# EAGLE design stepper-driver (EAGLE 5.00)
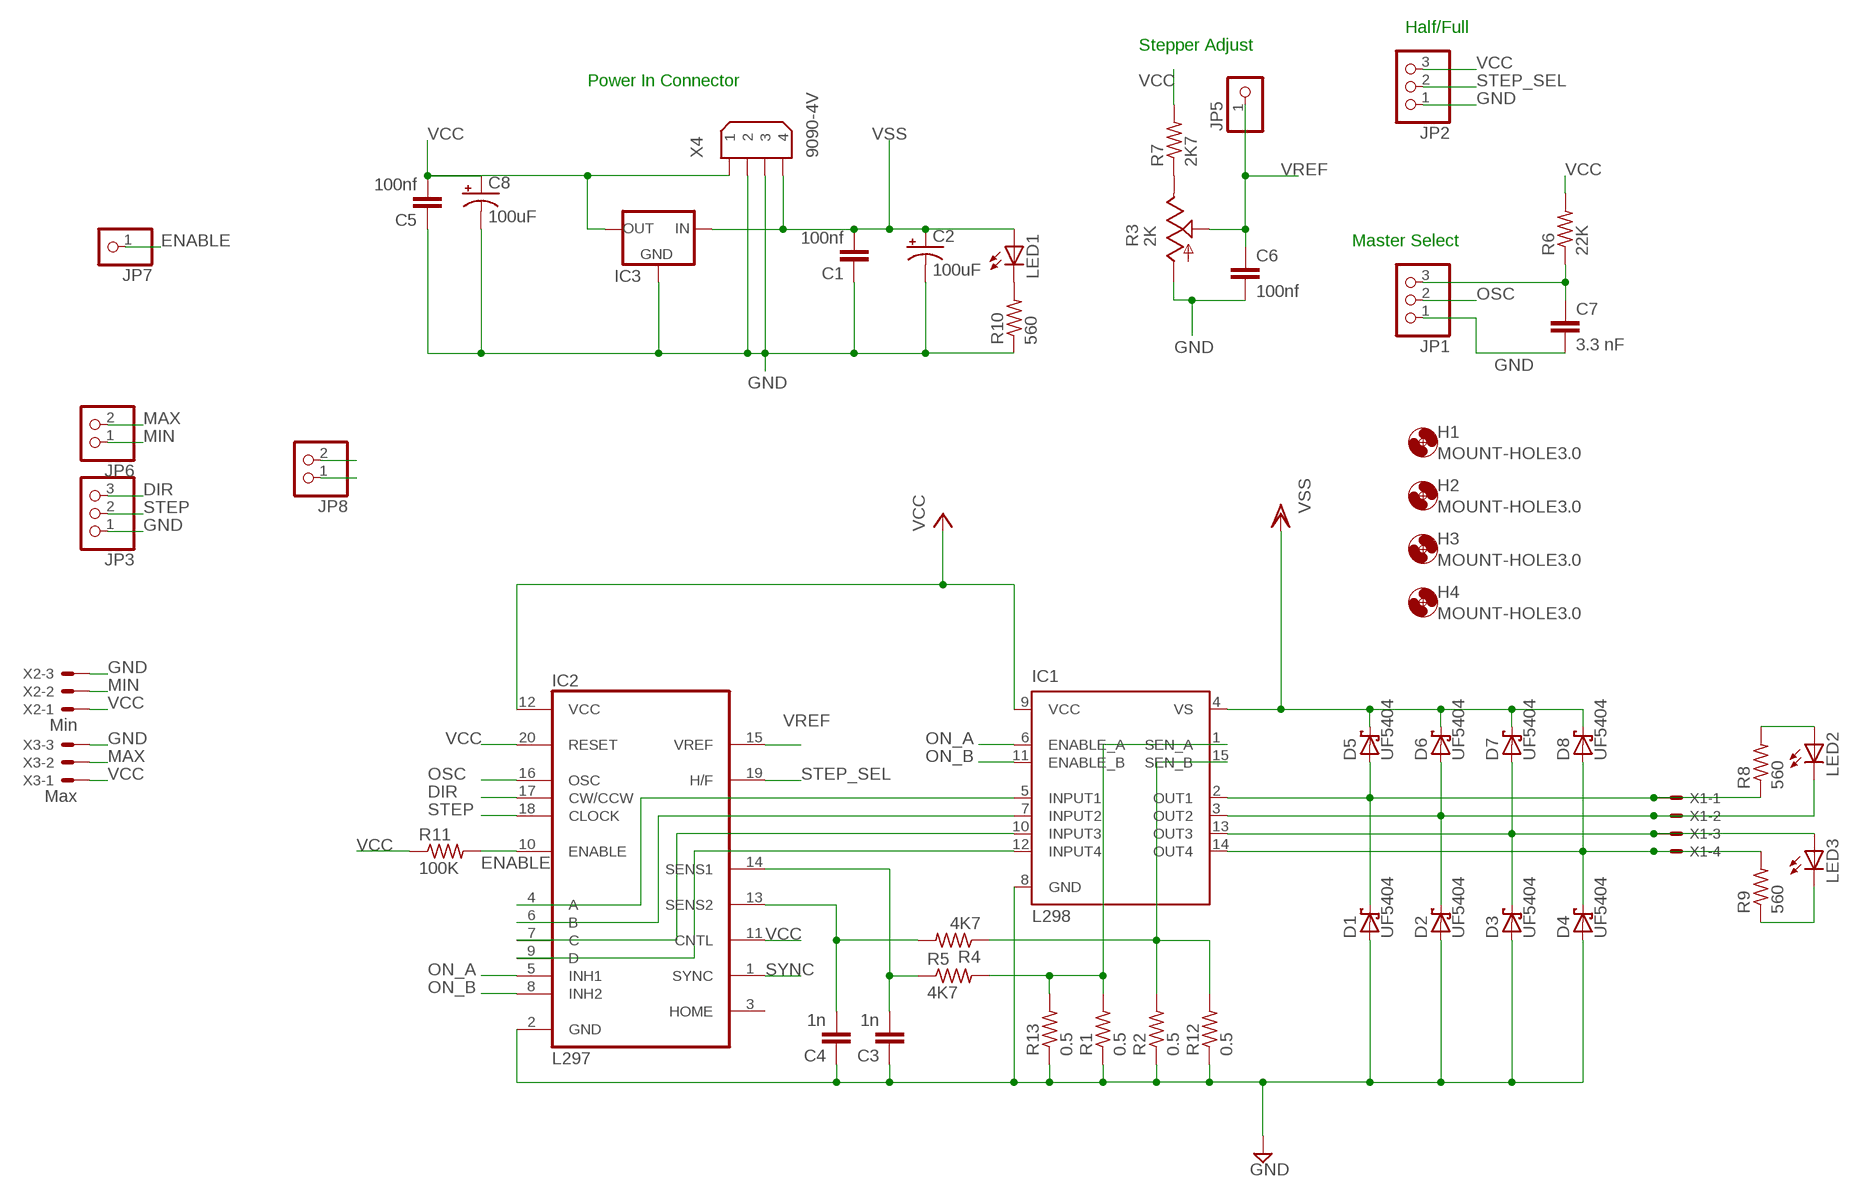
[diagram p0: schematic, sheet 1]

## Parts
C1  100nf  C-EU050-025X075  [C050-025X075]
C2  100uF  CPOL-USE5-6  [E5-6]
C3  1n  C-EU050-030X075  [C050-030X075]
C4  1n  C-EU050-030X075  [C050-030X075]
C5  100nf  C-EU050-025X075  [C050-025X075]
C6  100nf  C-EU050-035X075  [C050-035X075]
C7  3.3 nF  C5/3.5  [C5B3.5]
C8  100uF  CPOL-USE5-6  [E5-6]
D1  UF5404  SCHOTTKY-DIODECB429-15  [CB429-15]
D2  UF5404  SCHOTTKY-DIODECB429-15  [CB429-15]
D3  UF5404  SCHOTTKY-DIODECB429-15  [CB429-15]
D4  UF5404  SCHOTTKY-DIODECB429-15  [CB429-15]
D5  UF5404  SCHOTTKY-DIODECB429-15  [CB429-15]
D6  UF5404  SCHOTTKY-DIODECB429-15  [CB429-15]
D7  UF5404  SCHOTTKY-DIODECB429-15  [CB429-15]
D8  UF5404  SCHOTTKY-DIODECB429-15  [CB429-15]
H1  MOUNT-HOLE3.0  [3,0]
H2  MOUNT-HOLE3.0  [3,0]
H3  MOUNT-HOLE3.0  [3,0]
H4  MOUNT-HOLE3.0  [3,0]
IC1  L298  [MULTIWATT-15]
IC2  L297  [DIL20]
IC3  78LXX  [78LXX]
JP1  PINHD-1X3  [1X03]
JP2  PINHD-1X3  [1X03]
JP3  PINHD-1X3  [1X03]
JP5  PINHD-1X1  [1X01]
JP6  PINHD-1X2  [1X02]
JP7  PINHD-1X1  [1X01]
JP8  PINHD-1X2  [1X02]
LED1  LED5MM  [LED5MM]
LED2  LED3MM  [LED3MM]
LED3  LED3MM  [LED3MM]
R1  0.5  R-US_0309/12  [0309/12]
R2  0.5  R-US_0309/12  [0309/12]
R3  2K  TRIM_US-B25U  [B25U]
R4  4K7  R-US_0207/7  [0207/7]
R5  4K7  R-US_0207/7  [0207/7]
R6  22K  R-US_0207/7  [0207/7]
R7  2K7  R-US_0207/7  [0207/7]
R8  560  R-US_0207/7  [0207/7]
R9  560  R-US_0207/7  [0207/7]
R10  560  R-US_0207/7  [0207/7]
R11  100K  R-US_0207/7  [0207/7]
R12  0.5  R-US_0309/12  [0309/12]
R13  0.5  R-US_0309/12  [0309/12]
X1  KK-156-4  [KK-156-4]
X2  Min  22-23-2031  [22-23-2031]
X3  Max  22-23-2031  [22-23-2031]
X4  9090-4V  [9090-4V]

## Nets
DIR: IC2.17(CW/CCW) JP3.3
ENABLE: IC2.10(ENABLE) JP7.1 R11.2
GND [Ground]: C1.1 C2.- C3.1 C4.1 C5.1 C6.2 C7.2 C8.- D1.A D2.A D3.A D4.A IC1.8(GND) IC2.2(GND) IC3.GND JP1.1 JP2.1 JP3.1 R1.1 R2.1 R3.A R10.1 R12.1 R13.1 X2.3 X3.3 X4.2 X4.3
MAX: JP6.2 X3.2
MIN: JP6.1 X2.2
N$1: R3.E R7.1
N$2: LED3.K(C) R9.1
N$3: LED2.A R8.2
N$4: LED1.K(C) R10.2
N$25: IC1.5(INPUT1) IC2.4(A)
N$26: IC1.7(INPUT2) IC2.6(B)
N$27 [Power]: D4.C D8.A IC1.14(OUT4) R9.2 X1.4
N$28 [Power]: D3.C D7.A IC1.13(OUT3) LED3.A X1.3
N$29 [Power]: D2.C D6.A IC1.3(OUT2) LED2.K(C) X1.2
N$30 [Power]: D1.C D5.A IC1.2(OUT1) R8.1 X1.1
N$31: IC1.10(INPUT3) IC2.7(C)
N$32 [Power]: IC1.15(SEN_B) R2.2 R4.1 R12.2
N$33 [Power]: IC1.1(SEN_A) R1.2 R5.2 R13.2
N$34: IC1.12(INPUT4) IC2.9(D)
N$36: C4.2 IC2.13(SENS2) R4.2
N$37: C3.2 IC2.14(SENS1) R5.1
N$41: C7.1 JP1.3 R6.1
ON_A: IC1.6(ENABLE_A) IC2.5(INH1)
ON_B: IC1.11(ENABLE_B) IC2.8(INH2)
OSC: IC2.16(OSC) JP1.2
STEP: IC2.18(CLOCK) JP3.2
STEP_SEL: IC2.19(H/F) JP2.2
SYNC: IC2.1(SYNC) JP8.1 JP8.2
VCC: C5.2 C8.+ IC1.9(VCC) IC2.11(CNTL) IC2.12(VCC) IC2.20(RESET) IC3.OUT JP2.3 R6.2 R7.2 R11.1 X2.1 X3.1 X4.1
VREF: C6.1 IC2.15(VREF) JP5.1 R3.S
VSS [Power]: C1.2 C2.+ D5.C D6.C D7.C D8.C IC1.4(VS) IC3.IN LED1.A X4.4
Unconnected: IC2.3(HOME)

## Notes on the sheet
- Half/Full
- Stepper Adjust
- Power In Connector
- Master Select

## Library data of the parts
C1 C3-C6 = rcl:C-EU: CAPACITOR, European symbol
C2 C8 = rcl:CPOL-US: POLARIZED CAPACITOR, American symbol
C7 = capacitor-wima:C: CAPACITOR naming: grid - package width
D1-D8 = diode:SCHOTTKY-DIODE: Schottky Diode
H1-H4 = holes:MOUNT-HOLE: MOUNTING HOLE with drill center marker
IC1 = st-microelectronics:L298: DUAL FULL-BRIDGE DRIVER
IC2 = st-microelectronics:L297: STEPPER MOTOR CONTROLLER
IC3 = v-reg:78LXX: VOLTAGE REGULATOR
JP1-JP3 = pinhead:PINHD-1X3: PIN HEADER
JP5 JP7 = pinhead:PINHD-1X1: PIN HEADER
JP6 JP8 = pinhead:PINHD-1X2: PIN HEADER
LED1-LED3 = led:LED: LED OSRAM: - CHIPLED LG R971, LG N971, LY N971, LG Q971, LY Q971, LO R971, LY R971 LH N974, LH R974 LS Q976, LO Q976, LY Q976 LO Q996 - Hyper CHIPLED LW Q18S LB Q993, LB Q99A, LB R99A - SideLED LS A670, LO A670, LY A670, LG A670, LP A670 LB A673, LV A673, LT A673, LW A673 LH A674 LY A675 LS A676, LA A676, LO A676, LY A676, LW A676 LS A679, LY A679, LG A679 - Hyper Micro SIDELED® LS Y876, LA Y876, LO Y876, LY Y876 LT Y87S - SmartLED LW L88C, LW L88S LB L89C, LB L89S, LG L890 LS L89K, LO L89K, LY L89K LS L896, LA L896, LO L896, LY L896 - TOPLED LS T670, LO T670, LY T670, LG T670, LP T670 LSG T670, LSP T670, LSY T670, LOP T670, LYG T670 LG T671, LOG T671, LSG T671 LB T673, LV T673, LT T673, LW T673 LH T674 LS T676, LA T676, LO T676, LY T676, LB T676, LH T676, LSB T676, LW T676 LB T67C, LV T67C, LT T67C, LS T67K, LO T67K, LY T67K, LW E67C LS E67B, LA E67B, LO E67B, LY E67B, LB E67C, LV E67C, LT E67C LW T67C LS T679, LY T679, LG T679 LS T770, LO T770, LY T770, LG T770, LP T770 LB T773, LV T773, LT T773, LW T773 LH T774 LS E675, LA E675, LY E675, LS T675 LS T776, LA T776, LO T776, LY T776, LB T776 LHGB T686 LT T68C, LB T68C - Hyper Mini TOPLED® LB M676 - Mini TOPLED Santana® LG M470 LS M47K, LO M47K, LY M47K Source: http://www.osram.convergy.de - LUMILED® LXK2-PW12-R00, LXK2-PW12-S00, LXK2-PW14-U00, LXK2-PW14-V00 LXK2-PM12-R00, LXK2-PM12-S00, LXK2-PM14-U00 LXK2-PE12-Q00, LXK2-PE12-R00, LXK2-PE12-S00, LXK2-PE14-T00, LXK2-PE14-U00 LXK2-PB12-K00, LXK2-PB12-L00, LXK2-PB12-M00, LXK2-PB14-N00, LXK2-PB14-P00, LXK2-PB14-Q00 LXK2-PR12-L00, LXK2-PR12-M00, LXK2-PR14-Q00, LXK2-PR14-R00 LXK2-PD12-Q00, LXK2-PD12-R00, LXK2-PD12-S00 LXK2-PH12-R00, LXK2-PH12-S00 LXK2-PL12-P00, LXK2-PL12-Q00, LXK2-PL12-R00 Source: www.luxeon.com
R1 R2 R4-R13 = rcl:R-US_: RESISTOR, American symbol
R3 = pot:TRIM_US-: POTENTIOMETER
X1 = con-molex:KK-156-4: KK 156 HEADER Source: http://www.molex.com/pdm_docs/sd/026604100_sd.pdf
X2 X3 = con-molex:22-23-2031: .100" (2.54mm) Center Header - 3 Pin
X4 = con-thomas-betts:9090-4: Disk Drive Power four position Source: Thomas & Betts Electronic Interconnects Eiropean Edition 1998

## Net classes
0 default: width 0.406 mm, clearance 0.381 mm
1 Power: width 1.27 mm, clearance 0.381 mm
2 Signal: width 0.406 mm, clearance 0.381 mm
3 Ground: width 1.27 mm, clearance 0.381 mm

## Board
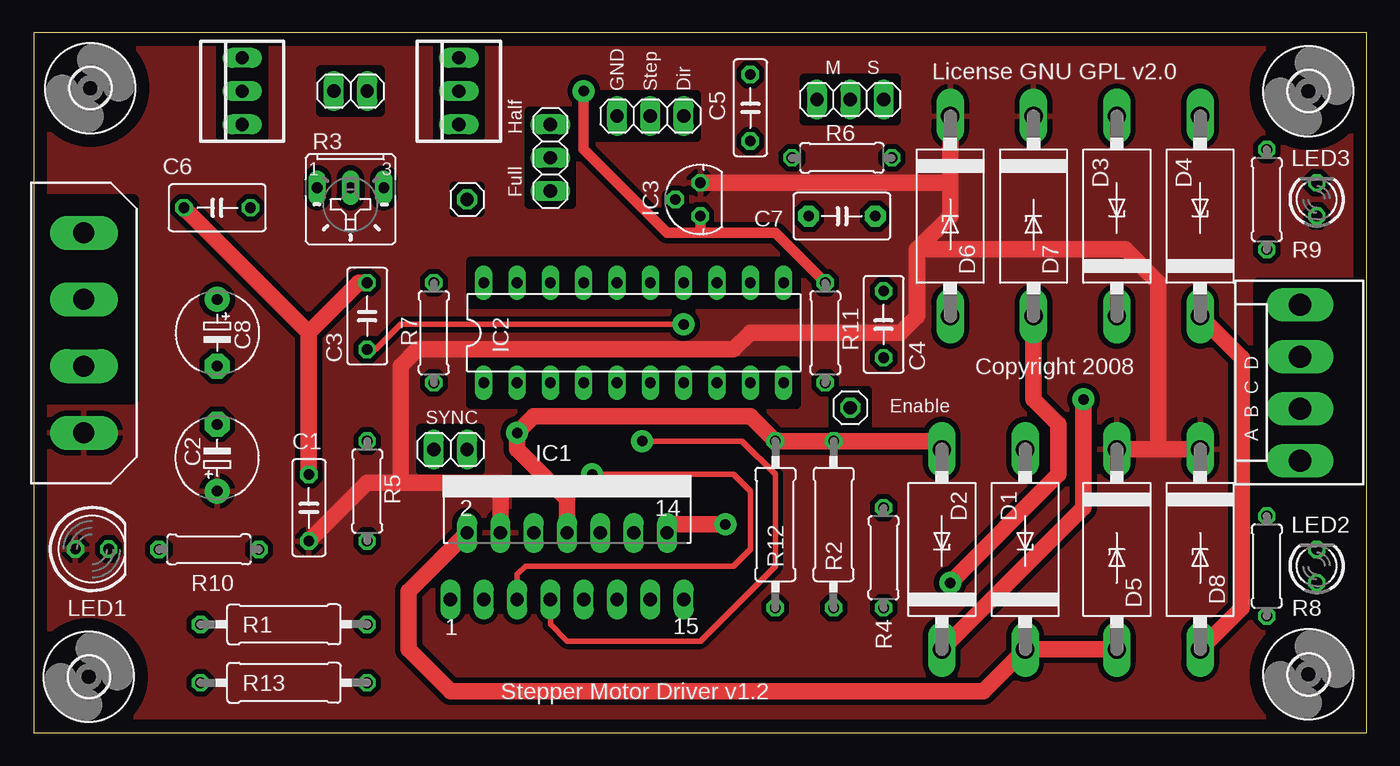
[diagram p1: board, top side]
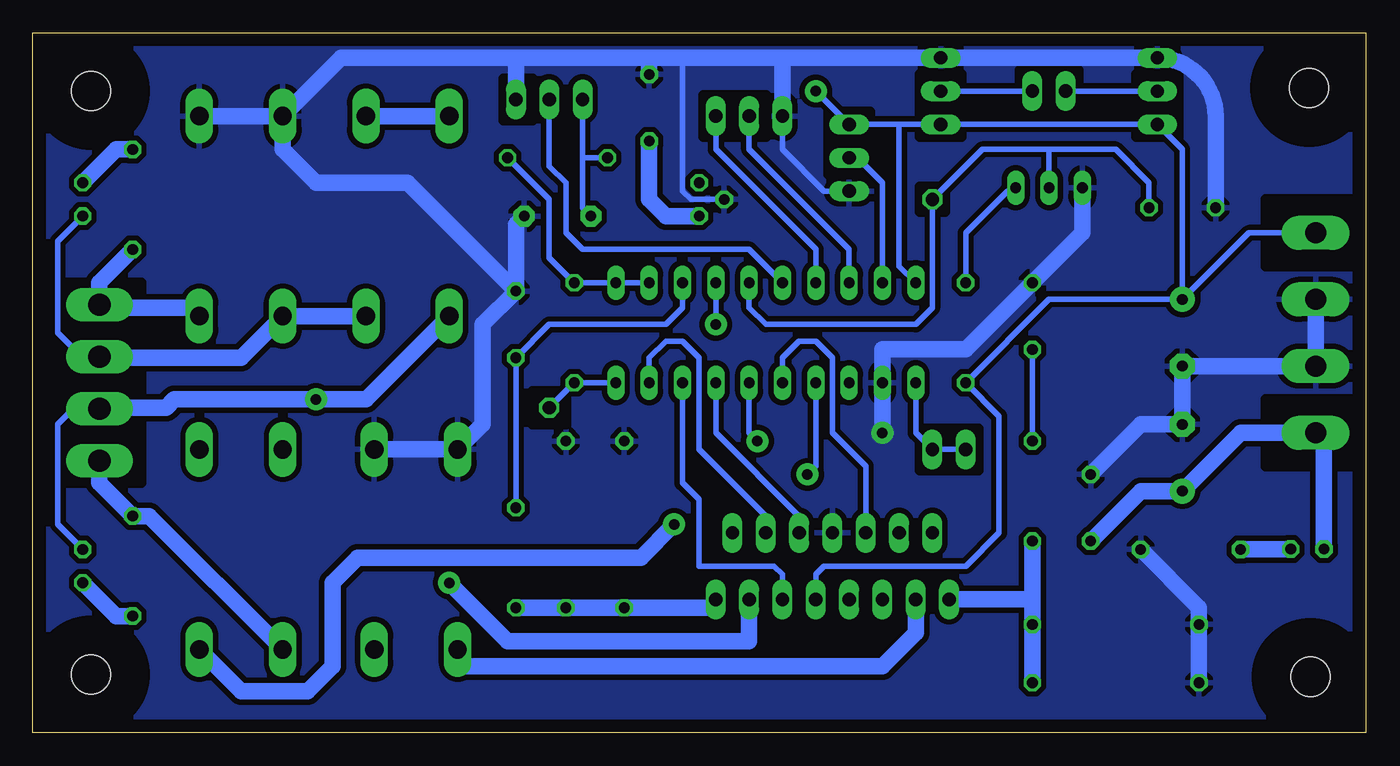
[diagram p2: board, bottom side, seen from below]

Size 101.6 x 53.34 mm. Coordinates in mm from the lower left corner, seen from the top.
Outline: 0,0 101.6,0 101.6,53.34 0,53.34 0,0
Copper layers (1*16): Top 0.035mm / dielectric 1.5mm / Bottom 0.035mm
Design rules "default *": minimum track width 12.5mil, minimum drill 0.8mm, track to track 15mil, track to pad 15mil, pad to pad 15mil, via to via 15mil, smd to smd 8mil, copper to edge 40mil, drill to drill 10mil, minimum pad ring 10mil, minimum via ring 8mil, stop-mask expansion 4mil, vias tented up to drill 0mil, thermal gap 16mil
tRestrict: area 58.7,46.7 to 65.7,49.8; area 33.3,25.1 to 58.1,28.3; area 33.3,32.7 to 58.1,35.9; area 0.6,25.4 to 7.6,40.6; area 93.3,19.1 to 100.3,34.3; area 29.5,20 to 34,23.2; area 37.8,40.3 to 41,47.3; area 61,23.5 to 63.5,26; area 21.9,47.3 to 26.4,50.5; area 32.1,39.7 to 34,41.6; area 14.3,45.4 to 17.5,52.4; area 30.8,45.4 to 34,52.4; 3 more areas
bRestrict: area 0.6,35.6 to 7.6,40.6; area 0.6,20.3 to 7.6,25.4; area 29.5,20 to 34,23.2; area 32.1,39.7 to 34,41.6; area 61,23.5 to 63.5,26; area 93.3,19.1 to 100.3,34.3; area 63.5,46.7 to 65.7,49.8; area 45.7,45.4 to 50.5,48.6; area 37.8,42.5 to 41,47.3; area 21.9,47.3 to 26.4,50.5; area 14.3,45.4 to 17.5,50.2; area 30.8,45.4 to 34,50.2; 1 more areas

### Footprints (pad centres in the part's own frame; a part is rotated, then mirrored left to right if it is on the bottom)
C050-025X075 = drill 0.813 octagon: 1 -2.54,0; 2 2.54,0
E5-6 = drill 0.813 pad 1.905 round: + -2.54,0 | drill 0.813 pad 1.905 octagon: - 2.54,0
C050-030X075 = drill 0.813 octagon: 1 -2.54,0; 2 2.54,0
C050-035X075 = drill 0.813 octagon: 1 -2.54,0; 2 2.54,0
C5B3.5 = drill 0.813 pad 1.6 octagon: 1 -2.54,0; 2 2.54,0
CB429-15 = drill 1.397 long: A 7.62,0; C -7.62,0
3,0 = hole 3: 0,0
MULTIWATT-15 = drill 1.016 long: 1 -8.89,-7.62; 2 -7.62,-2.54; 3 -6.35,-7.62; 4 -5.08,-2.54; 5 -3.81,-7.62; 6 -2.54,-2.54; 7 -1.27,-7.62; 8 0,-2.54; 9 1.27,-7.62; 10 2.54,-2.54; 11 3.81,-7.62; 12 5.08,-2.54; 13 6.35,-7.62; 14 7.62,-2.54; 15 8.89,-7.62
DIL20 = drill 0.813 long: 1 -11.43,-3.81; 2 -8.89,-3.81; 3 -6.35,-3.81; 4 -3.81,-3.81; 5 -1.27,-3.81; 6 1.27,-3.81; 7 3.81,-3.81; 8 6.35,-3.81; 9 8.89,-3.81; 10 11.43,-3.81; 11 11.43,3.81; 12 8.89,3.81; 13 6.35,3.81; 14 3.81,3.81; 15 1.27,3.81; 16 -1.27,3.81; 17 -3.81,3.81; 18 -6.35,3.81; 19 -8.89,3.81; 20 -11.43,3.81
78LXX = drill 0.813 octagon: GND 0,1.905; IN 1.27,0; OUT -1.27,0
1X03 = drill 1.016 long: 1 -2.54,0; 2 0,0; 3 2.54,0
1X01 = drill 1.016 octagon: 1 0,0
1X02 = drill 1.016 long: 1 -1.27,0; 2 1.27,0
LED5MM = drill 0.813 octagon: A -1.27,0; K 1.27,0
LED3MM = drill 0.813 octagon: A -1.27,0; K 1.27,0
0309/12 = drill 0.813 octagon: 1 -6.35,0; 2 6.35,0
B25U = drill 0.813 long: A 2.54,-0.889; E -2.54,-0.889; S 0,-0.889
0207/7 = drill 0.813 octagon: 1 -3.81,0; 2 3.81,0
KK-156-4 = drill 1.7 pad 2.184 long: 1 -5.94,0; 2 -1.98,0; 3 1.98,0; 4 5.94,0
22-23-2031 = drill 1 long: 1 -2.54,0; 2 0,0; 3 2.54,0
9090-4V = drill 1.6 pad 2.6 long: 1 -7.62,0; 2 -2.54,0; 3 2.54,0; 4 7.62,0

### Placement (x,y rotation side)
C1  20.95,17.14 270 top
C2  13.97,20.95 90 top
C3  25.4,31.75 270 top
C4  64.77,31.11 270 top
C5  54.61,47.62 270 top
C6  13.97,40.01 180 top
C7  61.59,39.37 0 top
C8  13.97,30.48 270 top
D1  75.56,13.97 90 top
D2  69.22,13.97 90 top
D3  82.55,39.37 90 top
D4  88.9,39.37 90 top
D5  82.55,13.97 270 top
D6  69.85,39.37 270 top
D7  76.2,39.37 270 top
D8  88.9,13.97 270 top
H1  97.16,4.45 0 top
H2  97.16,48.9 0 top
H3  4.19,4.27 0 top
H4  4.3,49.13 0 top
IC1  40.64,17.78 0 top
IC2  45.72,30.48 0 top
IC3  50.8,40.64 90 top
JP1  62.23,48.26 180 top
JP2  39.37,43.81 90 top
JP3  46.99,46.99 0 top
JP5  33.02,40.64 0 top
JP6  24.13,48.9 0 top
JP7  62.23,24.77 0 top
JP8  31.75,21.59 0 top
LED1  4.43,13.99 0 top
LED2  97.79,12.7 90 top
LED3  97.79,40.64 90 top
R1  19.05,8.26 0 top
R2  60.96,15.88 270 top
R3  24.13,40.64 180 top
R4  64.77,13.34 90 top
R5  25.4,18.41 270 top
R6  61.59,43.81 0 top
R7  30.48,30.48 270 top
R8  93.98,12.7 270 top
R9  93.98,40.64 270 top
R10  13.34,13.97 180 top
R11  60.33,30.48 270 top
R12  56.52,15.88 270 top
R13  19.05,3.81 0 top
X1  96.52,26.67 90 top
X2  15.88,48.9 90 top
X3  32.38,48.9 90 top
X4  3.81,30.48 270 top

### Tracks (layer width: path | path; a pad name or v marks a point on that pad's centre or on a via)
DIR
  Bottom 0.406: IC2.17 41.91,36.83 49.53,44.45 JP3.3
ENABLE
  Bottom 0.406: IC2.10 R11.2 JP7.1
GND  (via drill 0.8 pad 1.68)
  Top 1.27: D2.A 69.22,22.23 R2.1 R12.1 54.61,24.13 38.1,24.13 v36.83,22.86 36.83,21.59 40.64,17.78 IC1.8 | C1.1 20.95,30.48 | 20.95,30.48 C6.2 | C3.1 24.77,34.29 20.95,30.48
  Bottom 0.406: JP2.1 41.27,41.27 44.45,44.45 JP3.1 | IC3.GND 51.44,40.64 52.07,41.27 52.07,51.44
  Bottom 1.27: D1.A D2.A 67.31,23.5 67.31,31.11 C4.1 | D3.A D4.A | v36.83,22.86 IC2.2 36.83,29.21 30.48,29.21 C3.1 21.59,38.1 R3.A | D3.A 82.55,44.45 80.01,41.91 73.03,41.91 C4.1 | X4.2 X4.3 C8.- C2.- 17.14,23.5 C1.1 | R13.1 R1.1 12.7,9.53 R10.1 | 54.61,51.44 C5.1 | 44.45,51.44 52.07,51.44 54.61,51.44 | 54.61,51.44 64.77,51.44 | 64.77,51.44 78.11,51.44 D3.A | C6.2 11.43,46.99 arc-90 X2.3 X3.3 44.45,51.44 | 44.45,51.44 JP3.1 | C4.1 64.77,38.73 C7.2 | 64.77,51.44 JP1.1
  pour Bottom (isolate 0.406): 0,53.34 101.6,53.34 101.6,0 0,0
MAX
  Bottom 0.406: JP6.2 X3.2
MIN
  Bottom 0.406: X2.2 JP6.1
N$1
  Bottom 0.406: R7.1 30.48,38.1 27.3,41.27 26.67,41.27 R3.E
N$2
  Bottom 1.27: R9.1 95.25,44.45 LED3.K
N$3
  Bottom 1.27: R8.2 95.25,8.89 LED2.A
N$4
  Bottom 0.406: 5.71,13.97 5.71,13.98 LED1.K
  Bottom 1.27: 5.71,13.97 R10.2
N$25  (via drill 0.8 pad 1.68)
  Top 0.406: v42.55,19.68 53.34,19.68 54.61,18.41 54.61,13.97 53.34,12.7 37.47,12.7 36.83,12.06 IC1.5
  Bottom 0.406: v42.55,19.68 41.91,20.32 IC2.4
N$26  (via drill 0.8 pad 1.68)
  Top 0.406: v46.35,22.23 53.98,22.23 56.52,19.68 56.52,12.7 50.8,6.99 40.64,6.99 39.37,8.26 IC1.7
  Bottom 0.406: IC2.6 46.99,22.86 v46.35,22.23
N$27  (via drill 0.8 pad 1.68)
  Top 1.27: D8.A 92.08,9.53 92.08,28.57 D4.C | v52.7,15.88 48.26,15.88 IC1.14
  Bottom 1.27: R9.2 96.52,34.29 X1.4 96.52,32.38 89.53,32.38 D4.C | v52.7,15.88 55.24,13.34 76.83,13.34 78.74,11.43 78.74,5.08 80.64,3.17 85.72,3.17 D8.A
N$28  (via drill 0.8 pad 1.68)
  Top 1.27: D7.A 76.2,25.4 78.11,23.5 78.11,19.68 v69.85,11.43
  Bottom 0.406: LED3.A 99.69,37.47 99.69,30.48 97.79,28.57 96.52,28.57
  Bottom 1.27: D7.A D3.C 85.72,28.57 96.52,28.57 X1.3 | IC1.13 46.99,6.99 65.41,6.99 v69.85,11.43
N$29  (via drill 0.8 pad 1.68)
  Top 1.27: D2.C 80.01,17.14 v80.01,25.4
  Bottom 0.406: LED2.K 99.69,15.88 99.69,23.5 98.42,24.77 96.52,24.77
  Bottom 1.27: IC1.3 34.29,7.62 36.83,5.08 69.22,5.08 D2.C | X1.2 96.52,24.77 91.44,24.77 90.81,25.4 v80.01,25.4 76.2,25.4 D6.A
N$30
  Top 1.27: D5.A D1.C 72.39,3.17 31.75,3.17 28.57,6.35 28.57,10.79 IC1.2
  Bottom 1.27: D5.A 92.71,16.51 R8.1 96.52,19.05 X1.1
N$31
  Bottom 0.406: IC2.7 49.53,22.86 43.18,16.51 IC1.10
N$32
  Bottom 1.27: R4.1 R2.2 R12.2 49.53,9.53 IC1.15
N$33
  Bottom 1.27: 25.4,10.16 IC1.1 | 25.4,10.16 R5.2 | R13.2 R1.2 25.4,10.16
N$34
  Bottom 0.406: IC2.9 54.61,28.57 53.34,29.84 52.07,29.84 50.8,28.57 50.8,21.59 45.72,16.51 IC1.12
N$36
  Bottom 0.406: R4.2 C4.2 62.23,31.11 53.34,31.11 52.07,32.38 IC2.13
N$37  (via drill 0.8 pad 1.68)
  Top 0.406: v49.53,31.11 27.94,31.11 26.04,29.21 C3.2
  Bottom 0.406: v49.53,31.11 IC2.14 | R5.1 C3.2
N$41
  Bottom 0.406: C7.1 59.69,40.01 59.69,43.81 | 59.69,43.81 JP1.3 | 59.69,43.81 R6.1
ON_A
  Bottom 0.406: IC2.5 44.45,28.57 43.18,29.84 41.91,29.84 40.64,28.57 40.64,22.86 38.1,20.32 IC1.6
ON_B
  Bottom 0.406: IC2.8 52.07,19.05 50.8,17.78 50.8,12.7 45.09,12.7 44.45,12.06 IC1.11
OSC
  Bottom 0.406: IC2.16 46.99,36.83 59.69,36.83 60.96,38.1 60.96,41.91 62.23,43.18 JP1.2
STEP
  Bottom 0.406: JP3.2 46.99,44.45 39.37,36.83 IC2.18
STEP_SEL
  Bottom 0.406: IC2.19 36.83,41.91 38.73,43.81 JP2.2
SYNC
  Bottom 0.406: IC2.1 34.29,22.86 JP8.2 JP8.1
VCC  (via drill 0.8 pad 1.68)
  Top 0.813: 50.8,38.1 48.26,38.1 41.91,44.45 v41.91,48.9 | 50.8,38.1 56.52,38.1 R11.1 | 50.8,38.1 IC3.OUT
  Bottom 0.406: IC2.12 IC2.11 R11.1 62.23,36.2 62.23,40.64 R6.2 | IC1.9 41.91,12.06 41.27,12.7 30.48,12.7 27.94,15.24 27.94,24.13 R7.2 24.13,33.02 C8.+ | X4.1 8.89,38.1 C8.+ | C8.+ 13.97,44.45 X2.1 X3.1 35.56,46.35 | IC2.20 35.56,35.56 35.56,46.35 | 35.56,46.35 JP2.3 v41.91,48.9
  Bottom 1.27: IC3.OUT 53.34,39.37 54.61,40.64 C5.2
VREF
  Bottom 0.406: IC2.15 46.99,32.38 45.72,31.11 34.29,31.11 33.02,32.38 JP5.1 29.21,44.45 24.13,44.45 | C6.1 16.51,41.91 19.05,44.45 24.13,44.45 | 24.13,44.45 R3.S
VSS
  Top 1.27: 85.72,21.59 85.72,34.29 83.19,36.83 67.31,36.83 | 69.85,41.91 69.85,39.37 67.31,36.83 | 69.85,41.91 D6.C | 67.31,36.83 67.31,31.75 66.04,30.48 54.61,30.48 53.34,29.21 29.21,29.21 27.94,27.94 27.94,19.05 | IC1.4 35.56,19.05 27.94,19.05 | 85.72,21.59 D5.C | 85.72,21.59 D8.C | 69.85,41.91 IC3.IN | 27.94,19.05 25.4,19.05 C1.2
  Bottom 1.27: D6.C D7.C | C1.2 17.14,18.41 C2.+ 9.53,22.86 X4.4 3.17,22.86 3.17,13.99
  pour Top (isolate 0.406): 0,53.34 101.6,53.34 101.6,0 0,0

### Text on the board
tPlace: M | S | License GNU GPL v2.0 | GND | Step | Dir | Half | Full | Copyright 2008 | Enable | SYNC | A B C D | Stepper Motor Driver v1.2